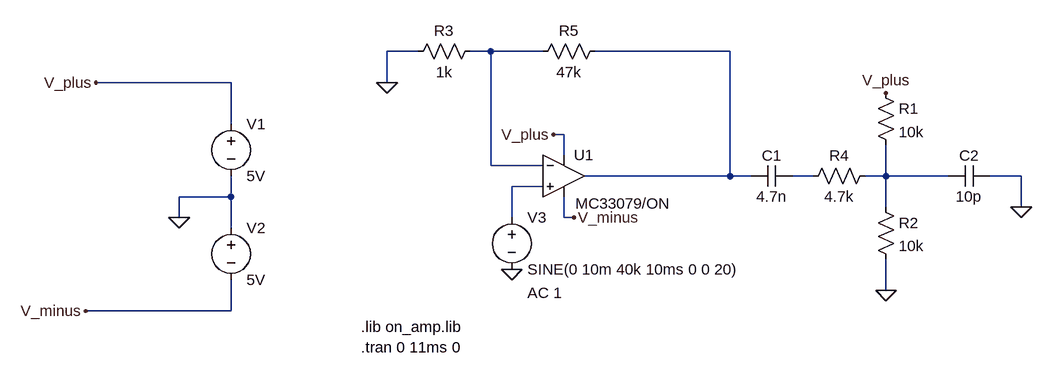
[diagram p0: schematic closedloop_gain_capload.asc]
closedloop_gain_capload.asc, the LTspice schematic file:
Version 4
SHEET 1 920 840
WIRE -752 -48 -800 -48
WIRE -640 -48 -672 -48
WIRE -560 -48 -640 -48
WIRE -272 -48 -480 -48
WIRE -1040 0 -1248 0
WIRE -800 0 -800 -48
WIRE -1040 64 -1040 0
WIRE -528 80 -544 80
WIRE -528 112 -528 80
WIRE -640 128 -640 -48
WIRE -560 128 -640 128
WIRE -272 144 -272 -48
WIRE -272 144 -496 144
WIRE -240 144 -272 144
WIRE -144 144 -176 144
WIRE -32 144 -32 96
WIRE -32 144 -64 144
WIRE 64 144 -32 144
WIRE 176 144 128 144
WIRE -560 160 -608 160
WIRE -1040 176 -1040 144
WIRE -1040 176 -1120 176
WIRE -32 192 -32 144
WIRE 176 192 176 144
WIRE -1120 208 -1120 176
WIRE -608 208 -608 160
WIRE -528 208 -528 176
WIRE -512 208 -528 208
WIRE -1040 224 -1040 176
WIRE -32 320 -32 272
WIRE -1040 352 -1040 304
WIRE -1040 352 -1264 352
FLAG -1120 208 0
FLAG -1248 0 V_plus
FLAG -1264 352 V_minus
FLAG -512 208 V_minus
FLAG -544 80 V_plus
FLAG -800 0 0
FLAG -32 320 0
FLAG -32 16 V_plus
FLAG -608 288 0
FLAG 176 192 0
SYMBOL Opamps\\opamp2 -528 80 R0
WINDOW 3 18 106 Left 0
SYMATTR Value MC33079/ON
SYMATTR InstName U1
SYMBOL voltage -1040 48 R0
WINDOW 123 0 0 Left 0
WINDOW 39 0 0 Left 0
SYMATTR InstName V1
SYMATTR Value 5V
SYMBOL voltage -1040 208 R0
WINDOW 123 0 0 Left 0
WINDOW 39 0 0 Left 0
SYMATTR InstName V2
SYMATTR Value 5V
SYMBOL res -656 -64 R90
WINDOW 0 0 56 VBottom 0
WINDOW 3 32 56 VTop 0
SYMATTR InstName R3
SYMATTR Value 1k
SYMBOL res -464 -64 R90
WINDOW 0 0 56 VBottom 0
WINDOW 3 32 56 VTop 0
SYMATTR InstName R5
SYMATTR Value 47k
SYMBOL res -48 0 R0
SYMATTR InstName R1
SYMATTR Value 10k
SYMBOL res -48 176 R0
SYMATTR InstName R2
SYMATTR Value 10k
SYMBOL voltage -608 192 R0
WINDOW 123 24 132 Left 0
WINDOW 39 0 0 Left 0
SYMATTR Value2 AC 1
SYMATTR InstName V3
SYMATTR Value SINE(0 10m 40k 10ms 0 0 20)
SYMBOL cap -176 128 R90
WINDOW 0 0 32 VBottom 0
WINDOW 3 32 32 VTop 0
SYMATTR InstName C1
SYMATTR Value 4.7n
SYMBOL res -48 128 R90
WINDOW 0 0 56 VBottom 0
WINDOW 3 32 56 VTop 0
SYMATTR InstName R4
SYMATTR Value 4.7k
SYMBOL cap 128 128 R90
WINDOW 0 0 32 VBottom 0
WINDOW 3 32 32 VTop 0
SYMATTR InstName C2
SYMATTR Value 10p
TEXT -840 376 Left 0 !.lib on_amp.lib
TEXT -840 408 Left 0 !.tran 0 11ms 0

The netlist it stands for:
* closedloop_gain_capload.asc
XU1 N005 N001 V_plus V_minus N002 MC33079/ON  ; pins In+ In- V+ V- OUT
V1 V_plus 0 5V
V2 0 V_minus 5V
R3 N001 0 1k
R5 N002 N001 47k
R1 V_plus N004 10k
R2 N004 0 10k
V3 N005 0 SINE(0 10m 40k 10ms 0 0 20) AC 1
C1 N003 N002 4.7n
R4 N004 N003 4.7k
C2 0 N004 10p
.lib on_amp.lib
.tran 0 11ms 0
.backanno
.end